# EAGLE design Prop_Dev_Stick (EAGLE 9.3.0)
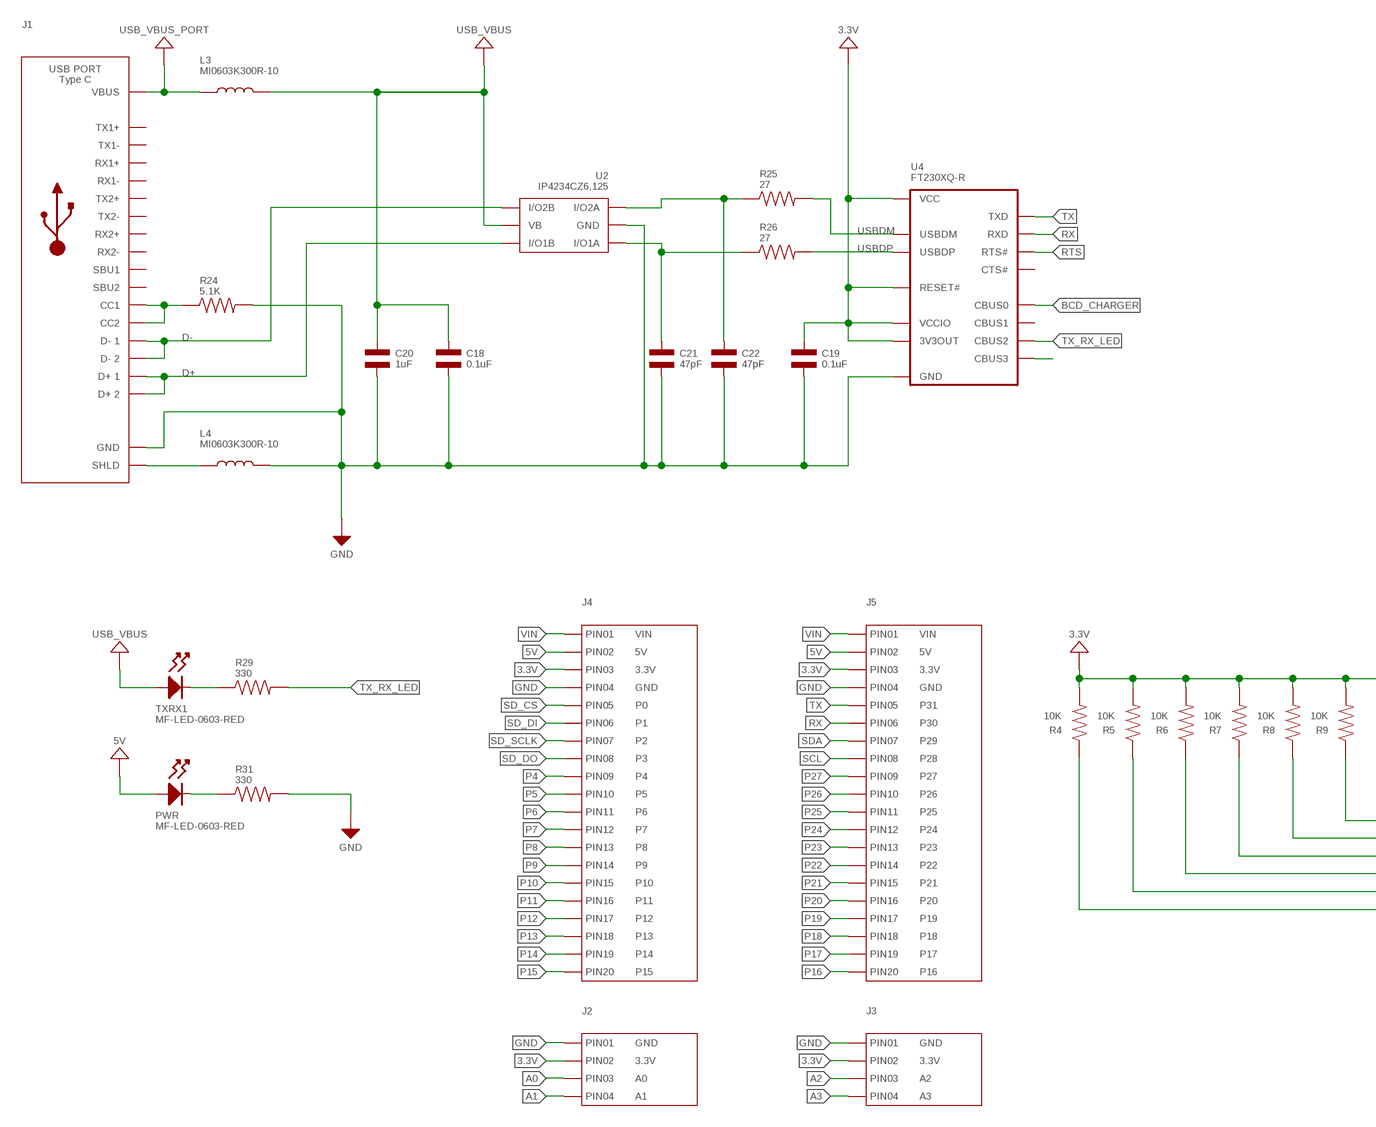
[diagram p0: schematic, sheet 1, part 1 of 3]
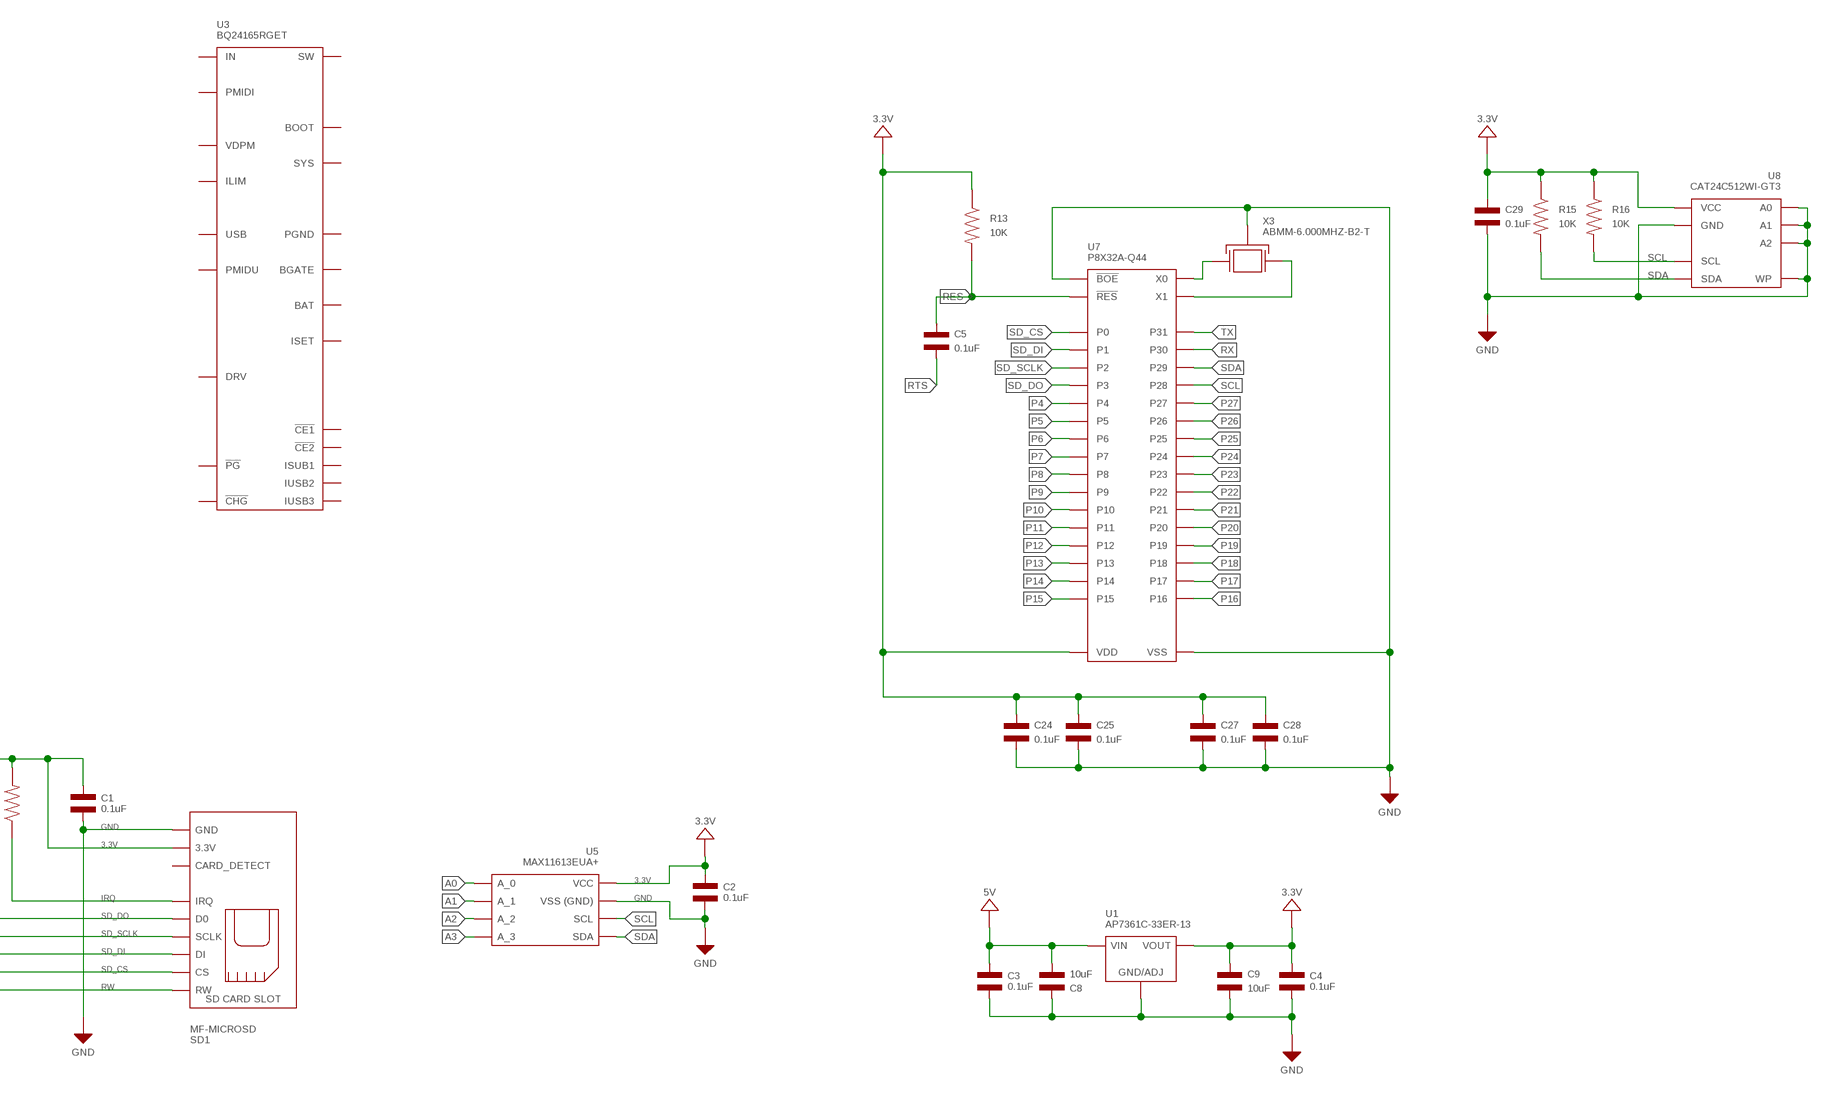
[diagram p1: schematic, sheet 1, part 2 of 3]
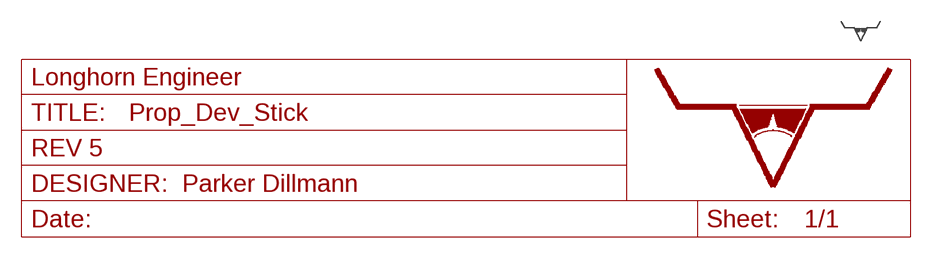
[diagram p2: schematic, sheet 1, part 3 of 3]

## Parts
C1  0.1uF  CAPACITOR_NP_0603  [C0603]
C2  0.1uF  CAPACITOR_NP_0603  [C0603]
C3  0.1uF  CAPACITOR_NP_0603  [C0603]
C4  0.1uF  CAPACITOR_NP_0603  [C0603]
C5  0.1uF  CAPACITOR_NP_0402  [C0402]
C8  10uF  CAPACITOR_NP_1206  [C1206]
C9  10uF  CAPACITOR_NP_1206  [C1206]
C18  0.1uF  CAPACITOR_NP_0603  [C0603]
C19  0.1uF  CAPACITOR_NP_0603  [C0603]
C20  1uF  CAPACITOR_NP_0603  [C0603]
C21  47pF  CAPACITOR_NP_0603  [C0603]
C22  47pF  CAPACITOR_NP_0603  [C0603]
C24  0.1uF  CAPACITOR_NP_0402  [C0402]
C25  0.1uF  CAPACITOR_NP_0402  [C0402]
C27  0.1uF  CAPACITOR_NP_0402  [C0402]
C28  0.1uF  CAPACITOR_NP_0402  [C0402]
C29  0.1uF  CAPACITOR_NP_0402  [C0402]
J1  USB_TYPE-C_105450-0101  [105450-0101]
J2  CON_01X04_2.54MM_PIN_HEADER  [2.54MM_01X04_PIN_HEADER]
J3  CON_01X04_2.54MM_PIN_HEADER  [2.54MM_01X04_PIN_HEADER]
J4  CON_01X20_2.54MM_PIN_HEADER  [2.54MM_01X20_PIN_HEADER]
J5  CON_01X20_2.54MM_PIN_HEADER  [2.54MM_01X20_PIN_HEADER]
L3  MI0603K300R-10  INDUCTOR_0603  [L0603]
L4  MI0603K300R-10  INDUCTOR_0603  [L0603]
PWR  MF-LED-0603-RED  LED_SINGLE-0603-RED  [LED0603]
R4  10K  RESISTOR_0603  [R0603]
R5  10K  RESISTOR_0603  [R0603]
R6  10K  RESISTOR_0603  [R0603]
R7  10K  RESISTOR_0603  [R0603]
R8  10K  RESISTOR_0603  [R0603]
R9  10K  RESISTOR_0603  [R0603]
R13  10K  RESISTOR_0402  [R0402]
R15  10K  RESISTOR_0402  [R0402]
R16  10K  RESISTOR_0402  [R0402]
R24  5.1K  RESISTOR_0603  [R0603]
R25  27  RESISTOR_0603  [R0603]
R26  27  RESISTOR_0603  [R0603]
R29  330  RESISTOR_0402  [R0402]
R31  330  RESISTOR_0402  [R0402]
SD1  MF-MICROSD  SD_CARD_SLOT_MICRO_RIGHT  [MF-MICROSD]
TXRX1  MF-LED-0603-RED  LED_SINGLE-0603-RED  [LED0603]
U1  AP7361C-33ER-13  LINEAR_VOTLAGE_REGULATORS_ADP3338  [ADP3338_SOT-223-3]
U2  IP4234CZ6,125  IP4234CZ6  [IP4234CZ6_SOT-457-6]
U3  BQ24165RGET  [BQ24165_QFN-24]
U4  FT230XQ-R  FT230XQ  [FT230X_QFN-16]
U5  MAX11613EUA+  [MAX11613_UMAX-8]
U7  P8X32A-Q44  P8X32A-M44  [P8X32A_QFN-44]
U8  CAT24C512WI-GT3  EEPROM_I2CSOIC-8_W  [SOIC-8_W]
U$1  LHE_FRAME  [LHE_FRAME]
U$2  LHE_LOGOLHE_LOGO  [LHE_LOGO]
X3  ABMM-6.000MHZ-B2-T  CYRSTAL_GND_ABMM  [7MMX5MM]

## Nets
3.3V: C1.P$1 C2.P$1 C4.P$1 C9.P$1 C19.P$1 C24.P$1 C25.P$1 C27.P$1 C28.P$1 C29.P$1 J2.2 J3.2 J4.3 J5.3 R4.P$2 R5.P$2 R6.P$2 R7.P$2 R8.P$2 R9.P$2 R13.P$1 R15.P$1 R16.P$1 SD1.PIN4(3.3V) U1.2(OUT) U1.PAD(OUT) U4.1(VCCIO) U4.8(3V3OUT) U4.9(RESET#) U4.10(VCC) U5.P$8(VCC) U7.8(VDD) U7.18(VDD) U7.30(VDD) U7.40(VDD) U8.8(VCC)
5V: C3.P$1 C8.P$2 J4.2 J5.2 PWR.ANODE U1.3(IN)
A0: J2.3 U5.P$1(A_0)
A1: J2.4 U5.P$2(A_1)
A2: J3.3 U5.P$3(A_2)
A3: J3.4 U5.P$4(A_3)
BCD_CHARGER: U4.12(CBUS0)
CC1/1: J1.A5(CC1) J1.B5(CC2) R24.P$1
D+: J1.A6(D+1) J1.B6(D+2) U2.3(I/O1B)
D-: J1.A7(D-1) J1.B7(D-2) U2.4(I/O2B)
GND: C1.P$2 C2.P$2 C3.P$2 C4.P$2 C8.P$1 C9.P$2 C18.P$2 C19.P$2 C20.P$2 C21.P$2 C22.P$2 C24.P$2 C25.P$2 C27.P$2 C28.P$2 C29.P$2 J1.A1(GND) J1.A12(GND) J1.B1(GND) J1.B12(GND) J2.1 J3.1 J4.4 J5.4 L4.P$2 R24.P$2 R31.P$2 SD1.G0(GND) SD1.G1(GND) SD1.PIN6(GND) U1.1(GND) U2.2(GND) U4.3(GND) U4.13(GND) U4.PAD(GND) U5.P$7(GND) U7.5(VSS) U7.6(!BOE) U7.17(VSS) U7.27(VSS) U7.39(VSS) U8.1(A0) U8.2(A1) U8.3(A2) U8.4(GND) U8.7(WP) X3.P$2(GND) X3.P$4(GND)
IRQ: R9.P$1 SD1.PIN8(IRQ)
N$1: U4.14(CBUS3)
N$2: R29.P$1 TXRX1.CATHODE
N$3: PWR.CATHODE R31.P$1
N$11: J1.S_T1(SHLD) J1.S_T2(SHLD) J1.S_T3(SHLD) J1.S_T4(SHLD) L4.P$1
N$16: C21.P$1 R26.P$1 U2.1(I/O1A)
N$17: C22.P$1 R25.P$1 U2.6(I/O2A)
P4: J4.9 U7.1(P4)
P5: J4.10 U7.2(P5)
P6: J4.11 U7.3(P6)
P7: J4.12 U7.4(P7)
P8: J4.13 U7.9(P8)
P9: J4.14 U7.10(P9)
P10: J4.15 U7.11(P10)
P11: J4.16 U7.12(P11)
P12: J4.17 U7.13(P12)
P13: J4.18 U7.14(P13)
P14: J4.19 U7.15(P14)
P15: J4.20 U7.16(P15)
P16: J5.20 U7.19(P16)
P17: J5.19 U7.20(P17)
P18: J5.18 U7.21(P18)
P19: J5.17 U7.22(P19)
P20: J5.16 U7.23(P20)
P21: J5.15 U7.24(P21)
P22: J5.14 U7.25(P22)
P23: J5.13 U7.26(P23)
P24: J5.12 U7.31(P24)
P25: J5.11 U7.32(P25)
P26: J5.10 U7.33(P26)
P27: J5.9 U7.34(P27)
RES: C5.P$1 R13.P$2 U7.7(!RES)
RTS: C5.P$2 U4.16(RTS#)
RW: R4.P$1 SD1.PIN1(RW)
RX: J5.6 U4.2(RXD) U7.37(P30)
SCL: J5.8 R16.P$2 U5.P$5(SCL) U7.35(P28) U8.6(SCL)
SD_CS: J4.5 R5.P$1 SD1.PIN2(CS) U7.41(P0)
SD_DI: J4.6 R6.P$1 SD1.PIN3(DI) U7.42(P1)
SD_DO: J4.8 R8.P$1 SD1.PIN7(D0) U7.44(P3)
SD_SCLK: J4.7 R7.P$1 SD1.PIN5(SCLK) U7.43(P2)
SDA: J5.7 R15.P$2 U5.P$6(SDA) U7.36(P29) U8.5(SDA)
TX: J5.5 U4.15(TXD) U7.38(P31)
TX_RX_LED: R29.P$2 U4.5(CBUS2)
USB_VBUS: C18.P$1 C20.P$1 L3.P$2 TXRX1.ANODE U2.5(VB)
USB_VBUS_PORT: J1.A4(VBUS) J1.A9(VBUS) J1.B4(VBUS) J1.B9(VBUS) L3.P$1
USBDM: R25.P$2 U4.7(USBDM)
USBDP: R26.P$2 U4.6(USBDP)
VIN: J4.1 J5.1
X4: U7.29(X0) X3.P$3(X1)
X5: U7.28(X1) X3.P$1(X0)
Unconnected: J1.A2(TX1+) J1.A3(TX1-) J1.A8(SBU1) J1.A10(RX2-) J1.A11(RX2+) J1.B2(TX2+) J1.B3(TX2-) J1.B8(SBU2) J1.B10(RX1-) J1.B11(RX1+) SD1.PIN9(CRD_DTCT) SD1.PIN10(CRD_DTCT) U3.1(VDPM) U3.2(IUSB3) U3.3(IUSB2) U3.4(ISUB1) U3.5(ISET) U3.6(DRV) U3.7(!PG) U3.8(!CHG) U3.9(!CE2) U3.10(BGATE) U3.11(BAT) U3.12(BAT) U3.13(SYS) U3.14(SYS) U3.15(ILIM) U3.16(PGND) U3.17(PGND) U3.18(SW) U3.19(BOOT) U3.20(PMIDI) U3.21(IN) U3.22(USB) U3.23(PMIDU) U3.24(!CE1) U3.PAD(PGND) U4.4(CTS#) U4.11(CBUS1)

## Library data of the parts
C1-C4 C8 C9 C18-C22 = MF_Passives:CAPACITOR_NP: Library: MF_Passives Description: Device for Non-Polarized Capacitors. Manufacture part number (MPN) can be added via Attributes. Check https://factory.macrofab.com/parts for the house parts list.; POPULATE: 1
C5 C24 C25 C27-C29 = MF_Passives:CAPACITOR_NP: Library: MF_Passives Description: Device for Non-Polarized Capacitors. Manufacture part number (MPN) can be added via Attributes. Check https://factory.macrofab.com/parts for the house parts list.; MPN: MF-CAP-0603-0.1uF; POPULATE: 1
J1 = PP_Connectors:USB_TYPE-C; POPULATE: 1
J2 = PP_Connectors:CON_01X04: 4 Pin Connectors; LABEL01: GND; LABEL02: 3.3V; LABEL03: A0; LABEL04: A1; POPULATE: 1
J3 = PP_Connectors:CON_01X04: 4 Pin Connectors; LABEL01: GND; LABEL02: 3.3V; LABEL03: A2; LABEL04: A3; POPULATE: 1
J4 = PP_Connectors:CON_01X20; LABEL01: VIN; LABEL02: 5V; LABEL03: 3.3V; LABEL04: GND; LABEL05: P0; LABEL06: P1; LABEL07: P2; LABEL08: P3; LABEL09: P4; LABEL10: P5; LABEL11: P6; LABEL12: P7; LABEL13: P8; LABEL14: P9; LABEL15: P10; LABEL16: P11; LABEL17: P12; LABEL18: P13; LABEL19: P14; LABEL20: P15; POPULATE: 1
J5 = PP_Connectors:CON_01X20; LABEL01: VIN; LABEL02: 5V; LABEL03: 3.3V; LABEL04: GND; LABEL05: P31; LABEL06: P30; LABEL07: P29; LABEL08: P28; LABEL09: P27; LABEL10: P26; LABEL11: P25; LABEL12: P24; LABEL13: P23; LABEL14: P22; LABEL15: P21; LABEL16: P20; LABEL17: P19; LABEL18: P18; LABEL19: P17; LABEL20: P16; POPULATE: 1
L3 L4 = MF_Passives:INDUCTOR: Library: MF_Passives Description: Device for Inductors. Manufacture part number (MPN) can be added via Attributes. Check https://factory.macrofab.com/parts for the house parts list.; POPULATE: 1
PWR TXRX1 = MF_LEDs:LED_SINGLE: Library: MF_LEDs Description: Device for Single LED Packages. Manufacture part number (MFG#) can be added via Attributes.; HOUSEPART: YES; MPN: MF-LED-0603-RED; POPULATE: 1; URL: https://factory.macrofab.com/part/MF-LED-0603-RED
R4-R9 R24-R26 R29 R31 = MF_Passives:RESISTOR: Library: MF_Passives Description: Device for Resistors. Manufacture part number (MPN), Voltage, Tolerance, and Wattage Rating can be added via Attributes. Check https://factory.macrofab.com/parts for the house parts list.; POPULATE: 1
R13 = MF_Passives:RESISTOR: Library: MF_Passives Description: Device for Resistors. Manufacture part number (MPN), Voltage, Tolerance, and Wattage Rating can be added via Attributes. Check https://factory.macrofab.com/parts for the house parts list.; MPN: MF-RES-0805-10K; POPULATE: 1
R15 R16 = MF_Passives:RESISTOR: Library: MF_Passives Description: Device for Resistors. Manufacture part number (MPN), Voltage, Tolerance, and Wattage Rating can be added via Attributes. Check https://factory.macrofab.com/parts for the house parts list.; MPN: MF-RES-0603-10K; POPULATE: 1
SD1 = MF_Connectors:SD_CARD_SLOT: Library: MF_Connectors Description: SD Card Connector; HOUSEPART: YES; MPN: MF-MICROSD; POPULATE: 1; URL: https://factory.macrofab.com/part/MF-MICROSD
U1 = PP_PowerIC:LINEAR_VOTLAGE_REGULATORS
U2 = PP_Passives:IP4234CZ6: Mouser Part #: 771-IP4234CZ6125 Manufacturer Part #: IP4234CZ6,125 Manufacturer: NXP Semiconductors Description: ESD Suppressors Single USB 2.0 ESD Protection 6-Pin http://www.mouser.com/ProductDetail/NXP-Semiconductors/IP4234CZ6125/?qs=sGAEpiMZZMvxHShE6Whpu7QUdHOfUl1T0xbl582qhFk%3d
U3 = PP_PowerIC:BQ24165; MFG: Texas Instruments; MPN: BQ24165RGET; POPULATE: 1
U4 = PP_DigitalIC:FT230X: Manufacturer Part #: FT230X Manufacturer: FTDI Description: USB Interface IC USB to Basic Serial UART IC
U5 = PP_AnalogIC:MAX11613: Manufacturer Part #: MAX11613 Manufacturer: Maxim Integrated Description: Analog to Digital Converters - ADC 12-Bit 4Ch 94.4sps 3.6V Precision ADC; POPULATE: 1
U7 = PP_DigitalIC:P8X32A: Manufacturer Part #: P8X32A Manufacturer: Parallax Description: 32-bit Microcontrollers - MCU Propeller Chip; MPN: P8X32A-Q44
U8 = PP_DigitalIC:EEPROM_I2C; MPN: CAT24C512WI-GT3
U$1 = PP_Aesthetics:LHE_FRAME; DNAME: Parker Dillmann; PNAME: Propeller Dev Stick; REVNUM: REV 5
U$2 = PP_Aesthetics:LHE_LOGO
X3 = MF_Frequency_Control:CYRSTAL_GND: Library: MF_Frequency_Control Description: Device for two functional pin Cyrstal Oscillators and a ground.; HOUSEPART: NO; MPN: ABMM-6.000MHZ-B2-T; POPULATE: 1; URL: http://www.abracon.com/Resonators/ABMM.pdf

## Board
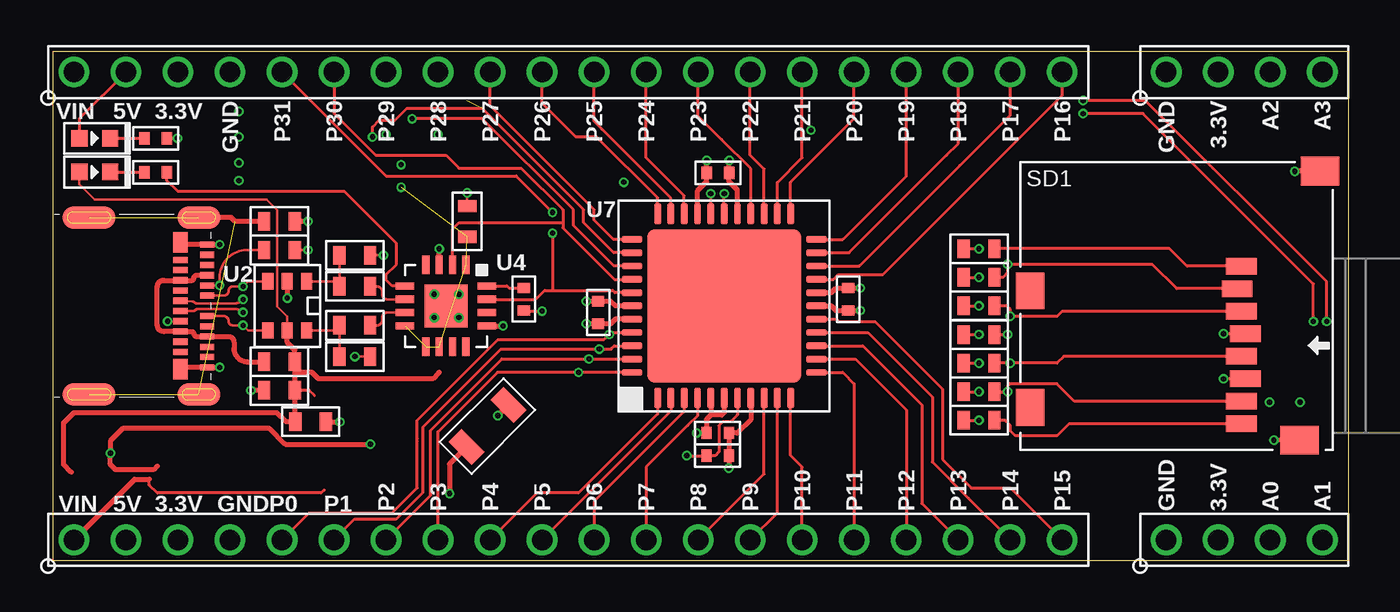
[diagram p3: board, top side]
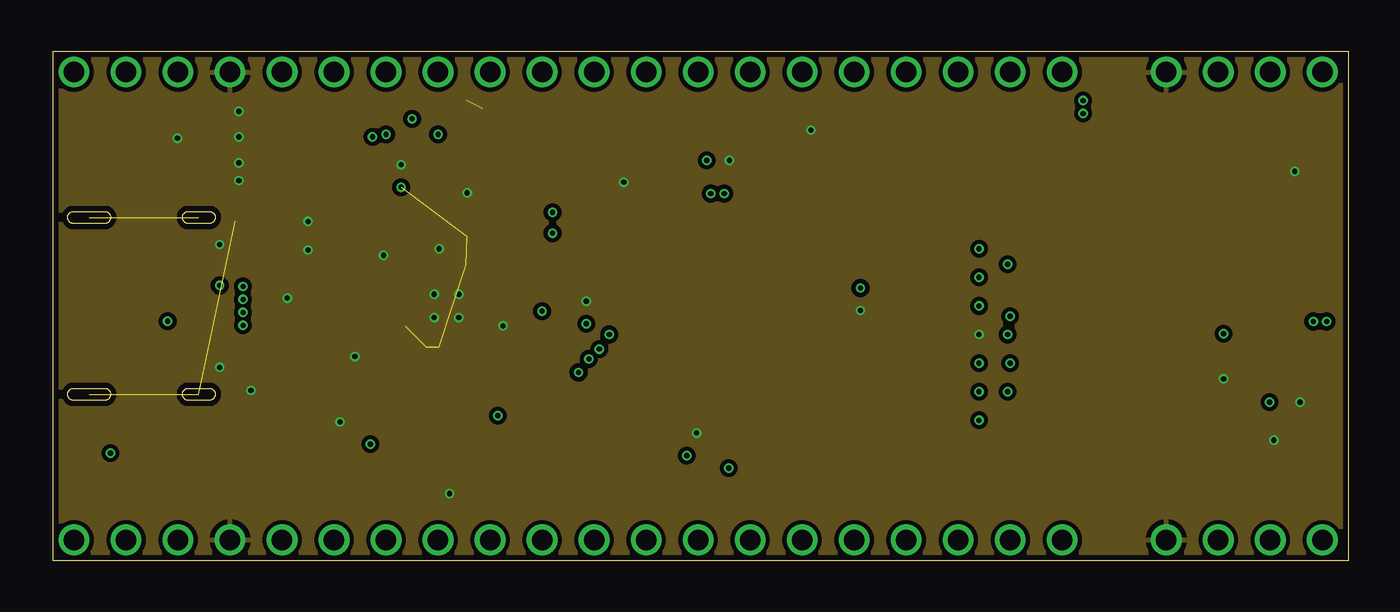
[diagram p4: board, inner layer Route2]
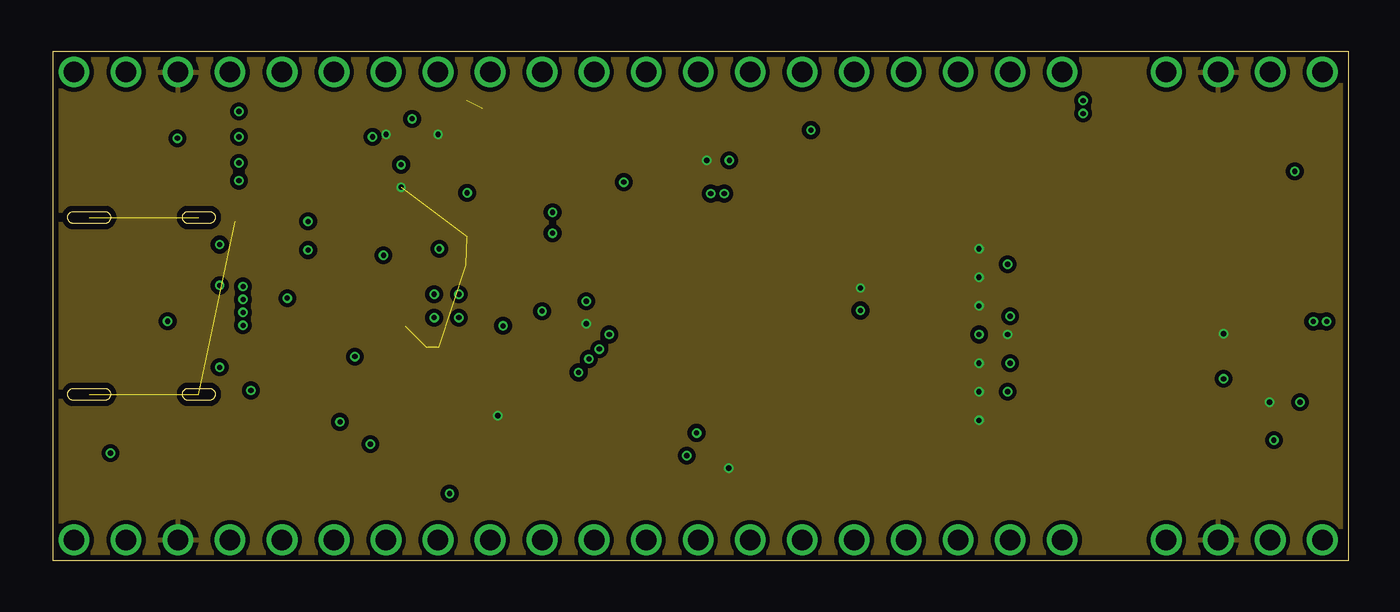
[diagram p5: board, inner layer Route15]
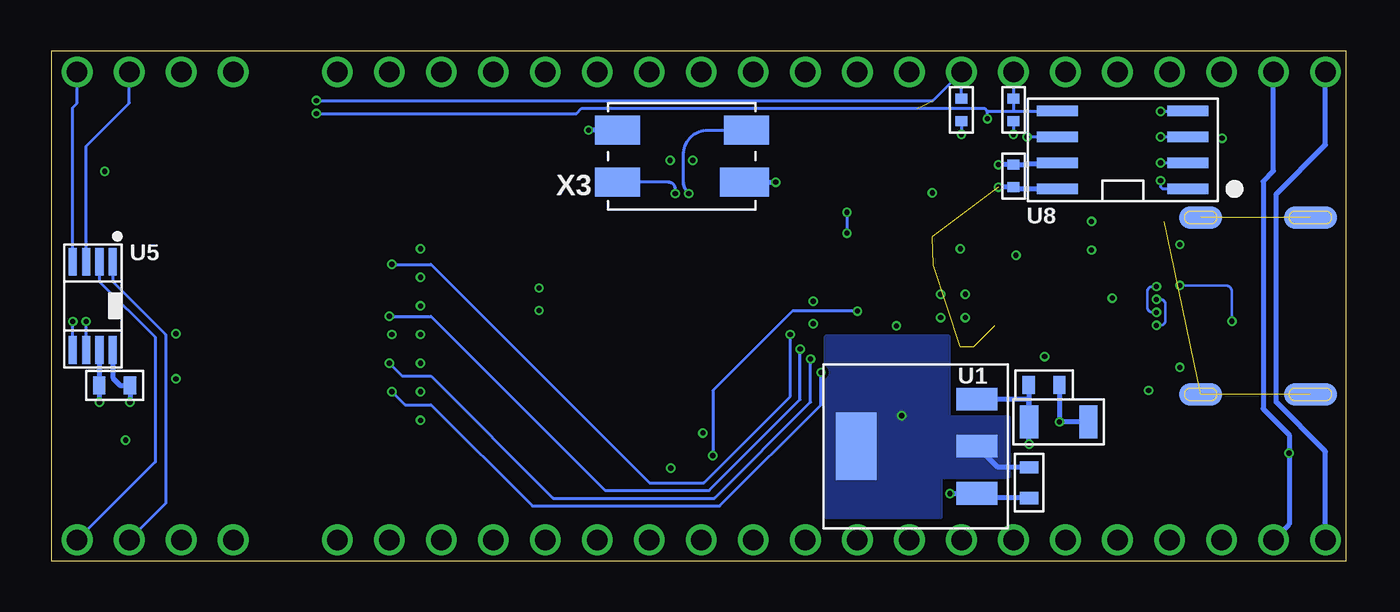
[diagram p6: board, bottom side, seen from below]

Size 63.25 x 24.89 mm. Coordinates in mm from the lower left corner, seen from the top.
Outline: 0,24.89 63.25,24.89 63.25,0 0,0 0,24.89
Copper layers (1*2*15*16): Top 0.035mm / dielectric 0.23mm / Route2 0.035mm / dielectric 0.93mm / Route15 0.035mm / dielectric 0.23mm / Bottom 0.035mm
Design rules "MF_Standard_4_Layer": minimum track width 5mil, minimum drill 10mil, track to track 5mil, track to pad 5mil, pad to pad 5mil, via to via 5mil, smd to smd 0mil, copper to edge 10mil, drill to drill 10mil, minimum pad ring 4mil, minimum via ring 4mil, stop-mask expansion 2mil, vias tented up to drill 25mil, thermal gap 10mil

### Footprints (pad centres in the part's own frame; a part is rotated, then mirrored left to right if it is on the bottom)
C0603 = smd 0.6 x 0.9: P$1 -0.75,0; P$2 0.75,0
C0402 = smd 0.5 x 0.6: P$1 -0.55,0; P$2 0.55,0
C1206 = smd 0.9 x 1.6: P$1 -1.45,0; P$2 1.45,0
105450-0101 = smd 0.3 x 0.7: A1 -3,0.41; A2 -2.5,0.41; A3 -2,0.41; A4 -1.5,0.41; A5 -1,0.41; A6 -0.5,0.41; A7 0.5,0.41; A8 1,0.41; A9 1.5,0.41; A10 2,0.41; A11 2.5,0.41; A12 3,0.41; B2 2.25,-0.89; B3 1.75,-0.89; B4 1.25,-0.89; B5 0.75,-0.89; B6 0.25,-0.89; B7 -0.25,-0.89; B8 -0.75,-0.89; B9 -1.25,-0.89; B10 -1.75,-0.89; B11 -2.25,-0.89 | smd 1 x 0.7: B1 3.1,-0.89; B12 -3.1,-0.89 | smd 1.1 x 2.6 bottom: S_B1 -4.32,-5.36; S_B4 4.32,-5.36 | smd 1.1 x 2.1 bottom: S_B2 -4.32,0; S_B3 4.32,0 | smd 1.1 x 2.6: S_T1 -4.32,-5.36; S_T4 4.32,-5.36 | smd 1.1 x 2.1: S_T2 -4.32,0; S_T3 4.32,0
2.54MM_01X04_PIN_HEADER = drill 1: 1 -3.81,0; 2 -1.27,0; 3 1.27,0; 4 3.81,0
2.54MM_01X20_PIN_HEADER = drill 1: 1 -24.13,0; 2 -21.59,0; 3 -19.05,0; 4 -16.51,0; 5 -13.97,0; 6 -11.43,0; 7 -8.89,0; 8 -6.35,0; 9 -3.81,0; 10 -1.27,0; 11 1.27,0; 12 3.81,0; 13 6.35,0; 14 8.89,0; 15 11.43,0; 16 13.97,0; 17 16.51,0; 18 19.05,0; 19 21.59,0; 20 24.13,0
L0603 = smd 0.6 x 0.9: P$1 -0.75,0; P$2 0.75,0
LED0603 = smd 0.8 x 0.8: ANODE 0.75,0; CATHODE -0.75,0
R0603 = smd 0.6 x 0.9: P$1 -0.75,0; P$2 0.75,0
R0402 = smd 0.5 x 0.6: P$1 -0.55,0; P$2 0.55,0
MF-MICROSD = smd 1.4 x 1.9: G0 -6.589,7.001; G1 6.561,6.001 | smd 0.8 x 1.5: PIN1 -1.939,3.151; PIN2 -0.839,2.951; PIN3 0.261,3.151; PIN4 1.361,3.351; PIN5 2.461,3.151; PIN6 3.561,3.351; PIN7 4.661,3.151; PIN8 5.761,3.151 | smd 1.8 x 1.4: PIN9 4.961,-7.149; PIN10 -0.739,-7.149
ADP3338_SOT-223-3 = smd 1.1 x 2: 1 -2.3,-2.54; 2 0,-2.54; 3 2.3,-2.54 | smd 3.3 x 2: PAD 0,3.36
IP4234CZ6_SOT-457-6 = smd 0.8 x 0.55: 1 -1.2,0.95; 2 -1.2,0; 3 -1.2,-0.95; 4 1.2,-0.95; 5 1.2,0; 6 1.2,0.95
BQ24165_QFN-24 = smd 0.58 x 0.24: 1 -1.913,1.25; 2 -1.913,0.75; 3 -1.913,0.25; 4 -1.913,-0.25; 5 -1.913,-0.75; 6 -1.913,-1.25; 13 1.913,-1.25; 14 1.913,-0.75; 15 1.913,-0.25; 16 1.913,0.25; 17 1.913,0.75; 18 1.913,1.25 | smd 0.24 x 0.58: 7 -1.25,-1.913; 8 -0.75,-1.913; 9 -0.25,-1.913; 10 0.25,-1.913; 11 0.75,-1.913; 12 1.25,-1.913; 19 1.25,1.913; 20 0.75,1.913; 21 0.25,1.913; 22 -0.25,1.913; 23 -0.75,1.913; 24 -1.25,1.913 | smd 2.7 x 2.7: PAD 0,0
FT230X_QFN-16 = smd 0.9 x 0.35: 1 -2,0.975; 2 -2,0.325; 3 -2,-0.325; 4 -2,-0.975; 9 2,-0.975; 10 2,-0.325; 11 2,0.325; 12 2,0.975 | smd 0.35 x 0.9: 5 -0.975,-2; 6 -0.325,-2; 7 0.325,-2; 8 0.975,-2; 13 0.975,2; 14 0.325,2; 15 -0.325,2; 16 -0.975,2 | smd 2.1 x 2.1: PAD 0,0
MAX11613_UMAX-8 = smd 1.35 x 0.4: P$1 -2.15,0.975; P$2 -2.15,0.325; P$3 -2.15,-0.325; P$4 -2.15,-0.975; P$5 2.15,-0.975; P$6 2.15,-0.325; P$7 2.15,0.325; P$8 2.15,0.975
P8X32A_QFN-44 = smd 1 x 0.33: 1 -4.5,3.25; 2 -4.5,2.6; 3 -4.5,1.95; 4 -4.5,1.3; 5 -4.5,0.65; 6 -4.5,0; 7 -4.5,-0.65; 8 -4.5,-1.3; 9 -4.5,-1.95; 10 -4.5,-2.6; 11 -4.5,-3.25; 23 4.5,-3.25; 24 4.5,-2.6; 25 4.5,-1.95; 26 4.5,-1.3; 27 4.5,-0.65; 28 4.5,0; 29 4.5,0.65; 30 4.5,1.3; 31 4.5,1.95; 32 4.5,2.6; 33 4.5,3.25 | smd 0.33 x 1: 12 -3.25,-4.5; 13 -2.6,-4.5; 14 -1.95,-4.5; 15 -1.3,-4.5; 16 -0.65,-4.5; 17 0,-4.5; 18 0.65,-4.5; 19 1.3,-4.5; 20 1.95,-4.5; 21 2.6,-4.5; 22 3.25,-4.5; 34 3.25,4.5; 35 2.6,4.5; 36 1.95,4.5; 37 1.3,4.5; 38 0.65,4.5; 39 0,4.5; 40 -0.65,4.5; 41 -1.3,4.5; 42 -1.95,4.5; 43 -2.6,4.5; 44 -3.25,4.5 | smd 7.5 x 7.5: PAD 0,0
SOIC-8_W = smd 2 x 0.5: 1 -3.185,1.905; 2 -3.185,0.635; 3 -3.185,-0.635; 4 -3.185,-1.905; 5 3.185,-1.905; 6 3.185,-0.635; 7 3.185,0.635; 8 3.185,1.905
7MMX5MM = smd 1.4 x 2.2: P$1 -1.27,3.15; P$2 1.27,3.15; P$3 1.27,-3.15 | smd 1.4 x 2.4: P$4 -1.27,-3.05

### Placement (x,y rotation side)
C1  45.21,11.05 180 top
C2  60.15,8.56 180 bottom
C3  14.76,8.59 0 bottom
C4  15.49,3.81 270 bottom
C5  22.99,12.78 90 top
C8  14.05,6.78 180 bottom
C9  21.21,6.58 225 top
C18  11.05,8.32 180 top
C19  20.22,16.57 90 top
C20  12.57,6.79 0 top
C21  14.73,14.92 0 top
C22  14.73,9.97 0 top
C24  32.45,6.24 180 top
C25  38.82,12.77 270 top
C27  32.46,18.95 0 top
C28  26.61,12.12 90 top
C29  16.26,18.8 90 bottom
J1  7.11,12.45 270 top
J2  58.17,1.02 0 top
J3  58.17,23.88 0 top
J4  25.15,1.02 0 top
J5  25.15,23.88 0 top
L3  11.05,9.72 0 top
L4  11.05,16.57 0 top
PWR  2.03,20.64 180 top
R4  45.21,15.24 180 top
R5  45.21,13.84 180 top
R6  45.21,12.45 180 top
R7  45.21,9.65 180 top
R8  45.21,8.26 180 top
R9  45.21,6.86 180 top
R13  32.45,5.13 180 top
R15  16.26,22.02 90 bottom
R16  18.8,22.02 90 bottom
R24  11.05,15.18 0 top
R25  14.73,11.49 0 top
R26  14.73,13.4 0 top
R29  5,18.97 0 top
R31  5,20.64 0 top
SD1  54.86,12.45 270 top
TXRX1  2.03,18.99 180 top
U1  20.57,5.59 90 bottom
U2  11.43,12.45 270 top
U3  -21.59,-1.02 0 top  (outside the outline)
U4  19.18,12.45 270 top
U5  61.21,12.45 270 bottom
U7  32.77,12.45 90 top
U8  10.92,20.07 180 bottom
U$1  -18.03,22.61 0 top  (outside the outline)
U$2  12.19,27.81 0 top
X3  32.44,19.76 90 bottom

### Tracks (layer width: path | path; a pad name or v marks a point on that pad's centre or on a via)
3.3V  (via drill 0.25)  (5 unrouted)
  Top 0.152: R4.P$2 v45.21,15.24 | R5.P$2 v45.21,13.84 | R6.P$2 v45.21,12.45 | C1.P$1 v46.61,11.05 | R7.P$2 v45.21,9.65 | R8.P$2 v45.21,8.26 | R9.P$2 v45.21,6.86 | SD1.PIN4 v57.15,11.09
  Top 0.254: U7.8 34.07,6.89 33.42,6.24 C24.P$1 R13.P$1 v32.99,4.52 | U7.18 38,13.1 38.23,13.32 C25.P$1 v39.42,13.32 | U7.40 27.45,11.8 27.23,11.57 C28.P$1 v26.04,11.57 | U7.30 31.47,18.07 31.91,18.52 C27.P$1 v31.91,19.56 | C9.P$1 v21.72,7.09
  Route15 0.152: v45.21,13.84 45.21,13.97
  Bottom 0.152: R16.P$1 v18.8,20.83 | R15.P$1 v16.26,20.83
  Bottom 0.254: U5.P$8 60.24,8.93 59.87,8.56 C2.P$1 v59.4,7.75 | U8.8 16.17,18.16 C29.P$1 v16.99,18.25 | C4.P$1 17.01,4.56 U1.2
  pour Bottom (no thermals): 16.51,6.99 19.43,6.99 19.43,10.92 25.4,10.92 25.4,2.16 19.81,2.16 19.81,4.11 16.51,4.11
  pour Route15 (isolate 0.203, rank 6): 0,24.89 63.25,24.89 63.25,0 0,0
5V  (via drill 0.25)
  Top 0.152: J5.2 1.28,21.6 PWR.ANODE
  Top 0.254: v15.49,5.69 11.33,5.69 10.57,6.45 3.4,6.45 2.79,5.84 v2.79,5.26 2.79,4.7 3.05,4.45 4.9,4.45 5.08,4.63
  Bottom 0.254: v15.49,5.69 C8.P$2 | 15.49,7.62 15.49,7.89 U1.3 | C3.P$1 15.51,7.62 15.49,7.62 | C8.P$2 | C8.P$2 15.49,7.62 | J4.2 2.79,1.78 v2.79,5.26 2.79,6.15 4.06,7.42 4.06,18.54 3.56,19.05 J5.2
A0
  Bottom 0.152: U5.P$1 60.24,13.63 59.31,12.7 57.66,11.05 57.66,2.79 J2.3
A1
  Bottom 0.152: U5.P$2 60.89,13.64 58.17,10.92 58.17,4.83 J2.4
A2
  Bottom 0.152: U5.P$3 61.54,20.25 59.44,22.35 J3.3
A3
  Bottom 0.152: U5.P$4 62.19,22.14 61.98,22.35 J3.4
CC1/1  (via drill 0.25)
  Top 0.127: J1.B5 v5.59,11.7 | J1.A5 v8.13,13.45 8.13,13.85 arc-90 9.46,15.18 R24.P$1
  Bottom 0.127: v5.59,11.7 5.59,13.15 arc-90 5.88,13.45 v8.13,13.45
D+  (via drill 0.25)
  Top 0.127: J1.B6 6.75,12.2 arc44 6.93,12.23 arc-44 7.06,12.29 8.87,12.29 arc-45 v9.27,12.13 | J1.A6 8.32,12.95 arc90 8.57,13.2 arc-90 8.77,13.4 v9.27,13.4 9.52,13.65 U2.3
  Bottom 0.127: v9.27,12.13 9.46,12.13 arc90 9.72,12.38 9.72,13.14 arc90 9.46,13.4 v9.27,13.4
D-  (via drill 0.25)
  Top 0.127: J1.B7 6.78,12.67 arc-44 6.91,12.61 arc44 7.09,12.57 8.89,12.57 arc45 9.21,12.71 v9.27,12.76 | J1.A7 8.32,11.95 arc-90 8.57,11.69 arc90 8.77,11.5 v9.27,11.5 9.52,11.25 U2.4
  Bottom 0.127: v9.27,12.76 9.08,12.76 arc90 8.83,12.51 8.83,11.75 arc90 9.08,11.5 v9.27,11.5
GND  (via drill 0.25)
  Top 0.127: v12.45,15.18 R24.P$2 | C21.P$2 v16.13,14.92 | C22.P$2 v14.73,9.97 | 19.18,11.87 v18.61,11.87 | 19.18,11.87 U4.PAD 19.18,13.02 | 19.18,11.87 v19.81,11.87 | 19.18,13.02 v18.61,13.02 | 19.18,13.02 v19.81,13.02 | v20.21,17.97 C19.P$2
  Top 0.152: R31.P$2 v6.07,20.64 | C1.P$2 v45.21,11.05 | SD1.PIN6 v57.15,8.88
  Top 0.254: J1.B1 6.22,9.45 J1.A12 v8.13,9.45 | J1.B12 6.22,15.45 J1.A1 v8.13,15.45 | v12.45,16.57 L4.P$2 | C18.P$2 v9.65,8.32 | U4.3 v18.85,15.24 | U4.13 v21.97,11.47 | v31.42,6.24 C24.P$2 31.9,6.89 32.12,7.11 | U7.5 32.12,7.11 | U7.6 32.77,7.24 32.64,7.11 32.12,7.11 | U7.17 38,12.45 38.23,12.22 C25.P$2 v39.42,12.22 | U7.39 27.45,12.45 27.23,12.67 C28.P$2 v26.04,12.67 | U7.27 33.42,18.11 33.01,18.52 C27.P$2 v33.01,19.56 v33.02,19.56 | SD1.G0 v60.63,19.02 | SD1.G1 v59.61,5.89 | v19.36,3.27 v19.36,3.28 19.36,4.72 C9.P$2 | U2.2 v11.43,12.83 | C20.P$2 v14.01,6.78
  Route15 0.254: v60.63,19.02 60.71,19.05
  Bottom 0.152: 7.74,21.95 v9.07,21.95 | U8.3 v9.07,20.7 | U8.2 v9.07,19.43 | U8.1 8.97,18.16 9.07,18.26 v9.07,18.57
  Bottom 0.254: U8.4 7.74,21.95 | U5.P$7 60.89,8.53 | 60.89,8.53 C2.P$2 | X3.P$2 v37.01,21.03 | X3.P$4 v27.86,18.49 | 60.89,8.53 v60.89,7.75 | 14.19,19.35 U8.7 14.13,19.41 15.54,19.41 15.6,19.35 C29.P$2 v16.99,19.35 | C8.P$1 v14.01,6.78 C3.P$2 | v19.36,3.28 v19.36,3.29 U1.1 18.03,3.06 C4.P$2
  pour Route2 (isolate 0.203, rank 6): 0,24.89 63.25,24.89 63.25,0 0,0
IRQ
  Top 0.152: SD1.PIN8 49.61,6.68 49.02,6.1 46.99,6.1 46.74,6.35 46.74,6.6 46.48,6.86 R9.P$1
N$2
  Top 0.152: TXRX1.CATHODE 4.45,18.99 R29.P$1
N$3
  Top 0.152: PWR.CATHODE R31.P$1
N$11  (3 unrouted)
  Top 0.254: L4.P$1 8.89,16.57 8.7,16.77 J1.S_T2
N$16
  Top 0.127: C21.P$1 R26.P$1 13.98,13.65 U2.1
N$17
  Top 0.127: R25.P$1 | C22.P$1 R25.P$1 | U2.6 13.98,11.25 R25.P$1
P4
  Top 0.152: U7.1 29.52,7.16 25.65,3.3 23.62,3.3 J4.9
P5
  Top 0.152: U7.2 30.17,7.31 J4.10
P6
  Top 0.152: U7.3 30.82,7.29 26.42,2.89 26.42,2.54 J4.11
P7
  Top 0.152: U7.4 31.47,7.08 30.99,6.6 28.96,4.57 J4.12
P8
  Top 0.152: J4.13 34.72,4.24 U7.9
P9
  Top 0.152: J4.14 35.37,2.35 U7.10
P10
  Top 0.152: J4.15 36.58,4.57 36.02,5.13 U7.11
P11
  Top 0.152: U7.12 38.56,9.2 39.12,8.64 J4.16
P12
  Top 0.152: U7.13 39.18,9.85 41.66,7.37 J4.17
P13
  Top 0.152: U7.14 39.54,10.5 42.42,7.62 42.42,2.79 J4.18
P14
  Top 0.152: U7.15 39.78,11.15 42.93,8 42.93,4.83 44.7,3.05 J4.19
P15
  Top 0.152: U7.16 38.24,11.8 38.35,11.68 40.13,11.68 43.43,8.38 43.43,4.95 44.83,3.56 46.74,3.56 J4.20
P16
  Top 0.152: U7.19 38.1,13.75 38.32,13.97 40.51,13.97 49.28,22.73 J5.20
P17
  Top 0.152: U7.20 39.37,14.4 44.28,19.3 46.74,21.76 J5.19
P18
  Top 0.152: U7.21 38.86,15.05 43.63,19.81 44.2,20.38 J5.18
P19
  Top 0.152: U7.22 38.56,15.7 41.66,18.8 J5.17
P20
  Top 0.152: U7.23 36.02,18.49 39.12,21.59 J5.16
P21
  Top 0.152: U7.24 35.37,18.48 36.58,19.68 J5.15
P22
  Top 0.152: U7.25 34.72,19.13 34.04,19.81 J5.14
P23
  Top 0.152: U7.26 34.07,19.15 32.64,20.57 31.5,21.72 J5.13
P24
  Top 0.152: U7.31 30.82,17.82 28.96,19.68 J5.12
P25
  Top 0.152: U7.32 30.17,17.71 26.8,21.08 26.42,21.46 J5.11
P26
  Top 0.152: U7.33 29.52,17.73 26.54,20.7 25.53,20.7 23.88,22.35 J5.10
P27
  Top 0.152: U7.34 27.36,15.7 26.42,16.64 26.42,17.14 23.24,20.32 21.34,22.23 J5.9
RES  (via drill 0.25)
  Top 0.152: U7.7 33.42,7.13 33.07,6.78 32.69,6.78 32.51,6.6 32.51,5.31 32.33,5.13 R13.P$2 v30.94,5.13 | C5.P$1 22.99,12.19 v23.88,12.19
  Bottom 0.152: v23.88,12.19 27.05,12.19 30.94,8.31 v30.94,5.13
RTS
  Top 0.152: U4.16 22.16,13.42 22.25,13.33 C5.P$2
RW
  Top 0.152: SD1.PIN1 55.37,14.38 54.52,15.24 R4.P$1
RX
  Top 0.152: U4.2 19.5,16.2 19.81,16.51 24.89,16.51 | 24.89,16.51 24.89,16.26 27.4,13.75 U7.37 | J5.6 13.72,21.84 15.75,19.81 19.18,19.81 19.81,19.18 22.86,19.18 24.89,17.14 24.89,16.51
SCL  (via drill 0.25)  (1 unrouted)
  Top 0.152: v15.6,20.7 15.6,21.18 15.93,21.51 16.69,21.51 17.25,22.07 20.98,22.07 25.91,17.14 25.91,16.51 27.37,15.05 U7.35 | v62.19,11.68 62.19,13.63 53.34,22.48 v50.29,22.48
  Bottom 0.152: U8.6 v15.6,20.7 | R16.P$2 J5.8 20.19,22.48 v50.29,22.48 | 62.23,10.3 U5.P$5 v62.19,11.68
SD_CS  (via drill 0.25)
  Top 0.152: SD1.PIN2 54.86,13.29 53.67,14.48 v46.61,14.48 46.61,14.07 46.38,13.84 R5.P$1 | J4.5 12.5,2.34 16.56,2.34 17.78,3.56 17.78,5.84 17.78,5.97 17.78,6.86 21.72,10.79 26.9,10.79 v27.15,11.05 27.25,11.15 U7.41
  Bottom 0.152: v46.61,14.48 44.7,14.48 34.04,3.81 31.37,3.81 27.15,8.03 v27.15,11.05
SD_DI  (via drill 0.25)
  Top 0.152: SD1.PIN3 49.27,12.19 49.02,11.94 v46.74,11.94 46.74,12.29 46.58,12.45 R6.P$1 | U7.42 27.41,10.5 27.25,10.34 v26.67,10.34 21.87,10.34 18.06,6.53 18.06,3.33 16.76,2.03 14.73,2.03 J4.6
  Bottom 0.152: v46.74,11.94 44.7,11.94 36.2,3.43 31.11,3.43 26.67,7.87 v26.67,10.34
SD_DO  (via drill 0.25)
  Top 0.152: SD1.PIN7 49.87,7.79 49.02,8.64 46.71,8.64 46.61,8.53 v46.61,8.26 R8.P$1 | J4.8 18.8,6.3 21.69,9.2 v25.65,9.2 U7.44
  Bottom 0.152: v46.61,8.26 45.97,7.62 44.7,7.62 39.75,2.67 30.61,2.67 25.65,7.62 v25.65,9.2
SD_SCLK  (via drill 0.25)
  Top 0.152: SD1.PIN5 49.35,9.98 49.02,9.65 v46.74,9.65 R7.P$1 | J4.7 18.44,3.2 18.44,6.38 21.92,9.86 v26.16,9.86 U7.43
  Bottom 0.152: v46.74,9.65 46.1,9.02 44.7,9.02 38.73,3.05 30.86,3.05 26.16,7.75 v26.16,9.86
SDA  (via drill 0.25)
  Top 0.152: U7.36 27.39,14.4 25.4,16.38 25.4,17.14 20.95,21.59 v17.53,21.59 | v61.54,11.68 61.54,13.52 53.21,21.84 v50.29,21.84
  Bottom 0.152: J5.7 R15.P$2 16.26,21.97 | v17.53,21.59 17.53,21.97 | 17.53,21.97 16.26,21.97 | 16.26,21.97 U8.5 | U5.P$6 v61.54,11.68 | v50.29,21.84 37.59,21.84 37.34,22.1 17.65,22.1 17.53,21.97
TX  (via drill 0.25)
  Top 0.152: U7.38 27.43,13.1 27.32,13.21 24.38,13.21 | J5.5 16.26,18.8 22.61,18.8 v24.38,17.02 | U4.15 23.57,12.77 24,13.21 24.38,13.21 | v24.38,16 24.38,13.21
  Bottom 0.152: v24.38,17.02 v24.38,16
TX_RX_LED
  Top 0.152: U4.5 16.55,13.42 16.26,13.72 16.26,13.97 16.76,14.48 16.76,15.49 14.22,18.03 6.1,18.03 5.55,18.58 R29.P$2
USB_VBUS
  Top 0.127: TXRX1.ANODE 1.28,18.4 2.03,17.65 10.41,17.65 10.95,17.12 10.95,12.42 11.43,11.94 U2.5
  Top 0.152: C18.P$1 12.51,8.32 12.76,8.06
  Top 0.254: 11.75,9.72 L3.P$2 | L3.P$2 C18.P$1 | 18.85,9.21 18.8,9.14 18.54,8.89 12.95,8.89 12.64,9.21 11.8,9.21 C18.P$1 | 0.89,4.32 0.51,4.7 0.51,6.73 1.02,7.24 10.92,7.24 11.37,6.79 11.8,6.79 | L3.P$2 11.8,10.3 11.43,10.67 U2.5 | 11.8,6.79 C20.P$1 | C18.P$1 11.8,6.79
USB_VBUS_PORT
  Top 0.254: J1.A4 7.03,13.95 arc90 6.86,13.77 arc-90 6.78,13.7 J1.B9 5.4,13.7 arc90 5.08,13.38 5.08,11.51 arc90 5.4,11.2 J1.B4 6.78,11.2 arc-90 6.86,11.12 arc90 7.03,10.95 J1.A9 8.57,10.95 arc-90 8.83,10.69 8.83,10.38 arc90 9.49,9.72 L3.P$1
USBDM
  Top 0.127: R25.P$2 15.81,11.49 arc90 16.07,11.75 16.07,11.87 arc-90 16.32,12.13 U4.7
USBDP
  Top 0.127: R26.P$2 15.81,13.4 arc-90 16.07,13.14 16.07,13.02 arc90 16.32,12.76 U4.6
VIN
  Top 0.152: 13.23,3.45 13.08,3.3 5.08,3.3 4.7,3.68 4.7,3.98
  Top 0.254: J4.1 3.98,3.98 4.7,3.98
  Bottom 0.254: J4.1 1.02,5.33 3.43,7.75 3.43,17.91 1.02,20.32 J5.1
X4  (via drill 0.25)
  Top 0.152: U7.29 v32.12,17.93
  Bottom 0.152: v32.12,17.93 arc45 32.37,18.55 32.37,19.84 arc90 31.18,21.03 X3.P$3
X5  (via drill 0.25)
  Top 0.152: U7.28 v32.77,17.93
  Bottom 0.152: v32.77,17.93 32.77,18.15 arc-90 33.11,18.49 X3.P$1